# EasyEDA schematic schematic.json
TITLE: Roller System; REV: 1.2; Date: 2018-11-19; Sheet: 1/1; Drawn By: saikek
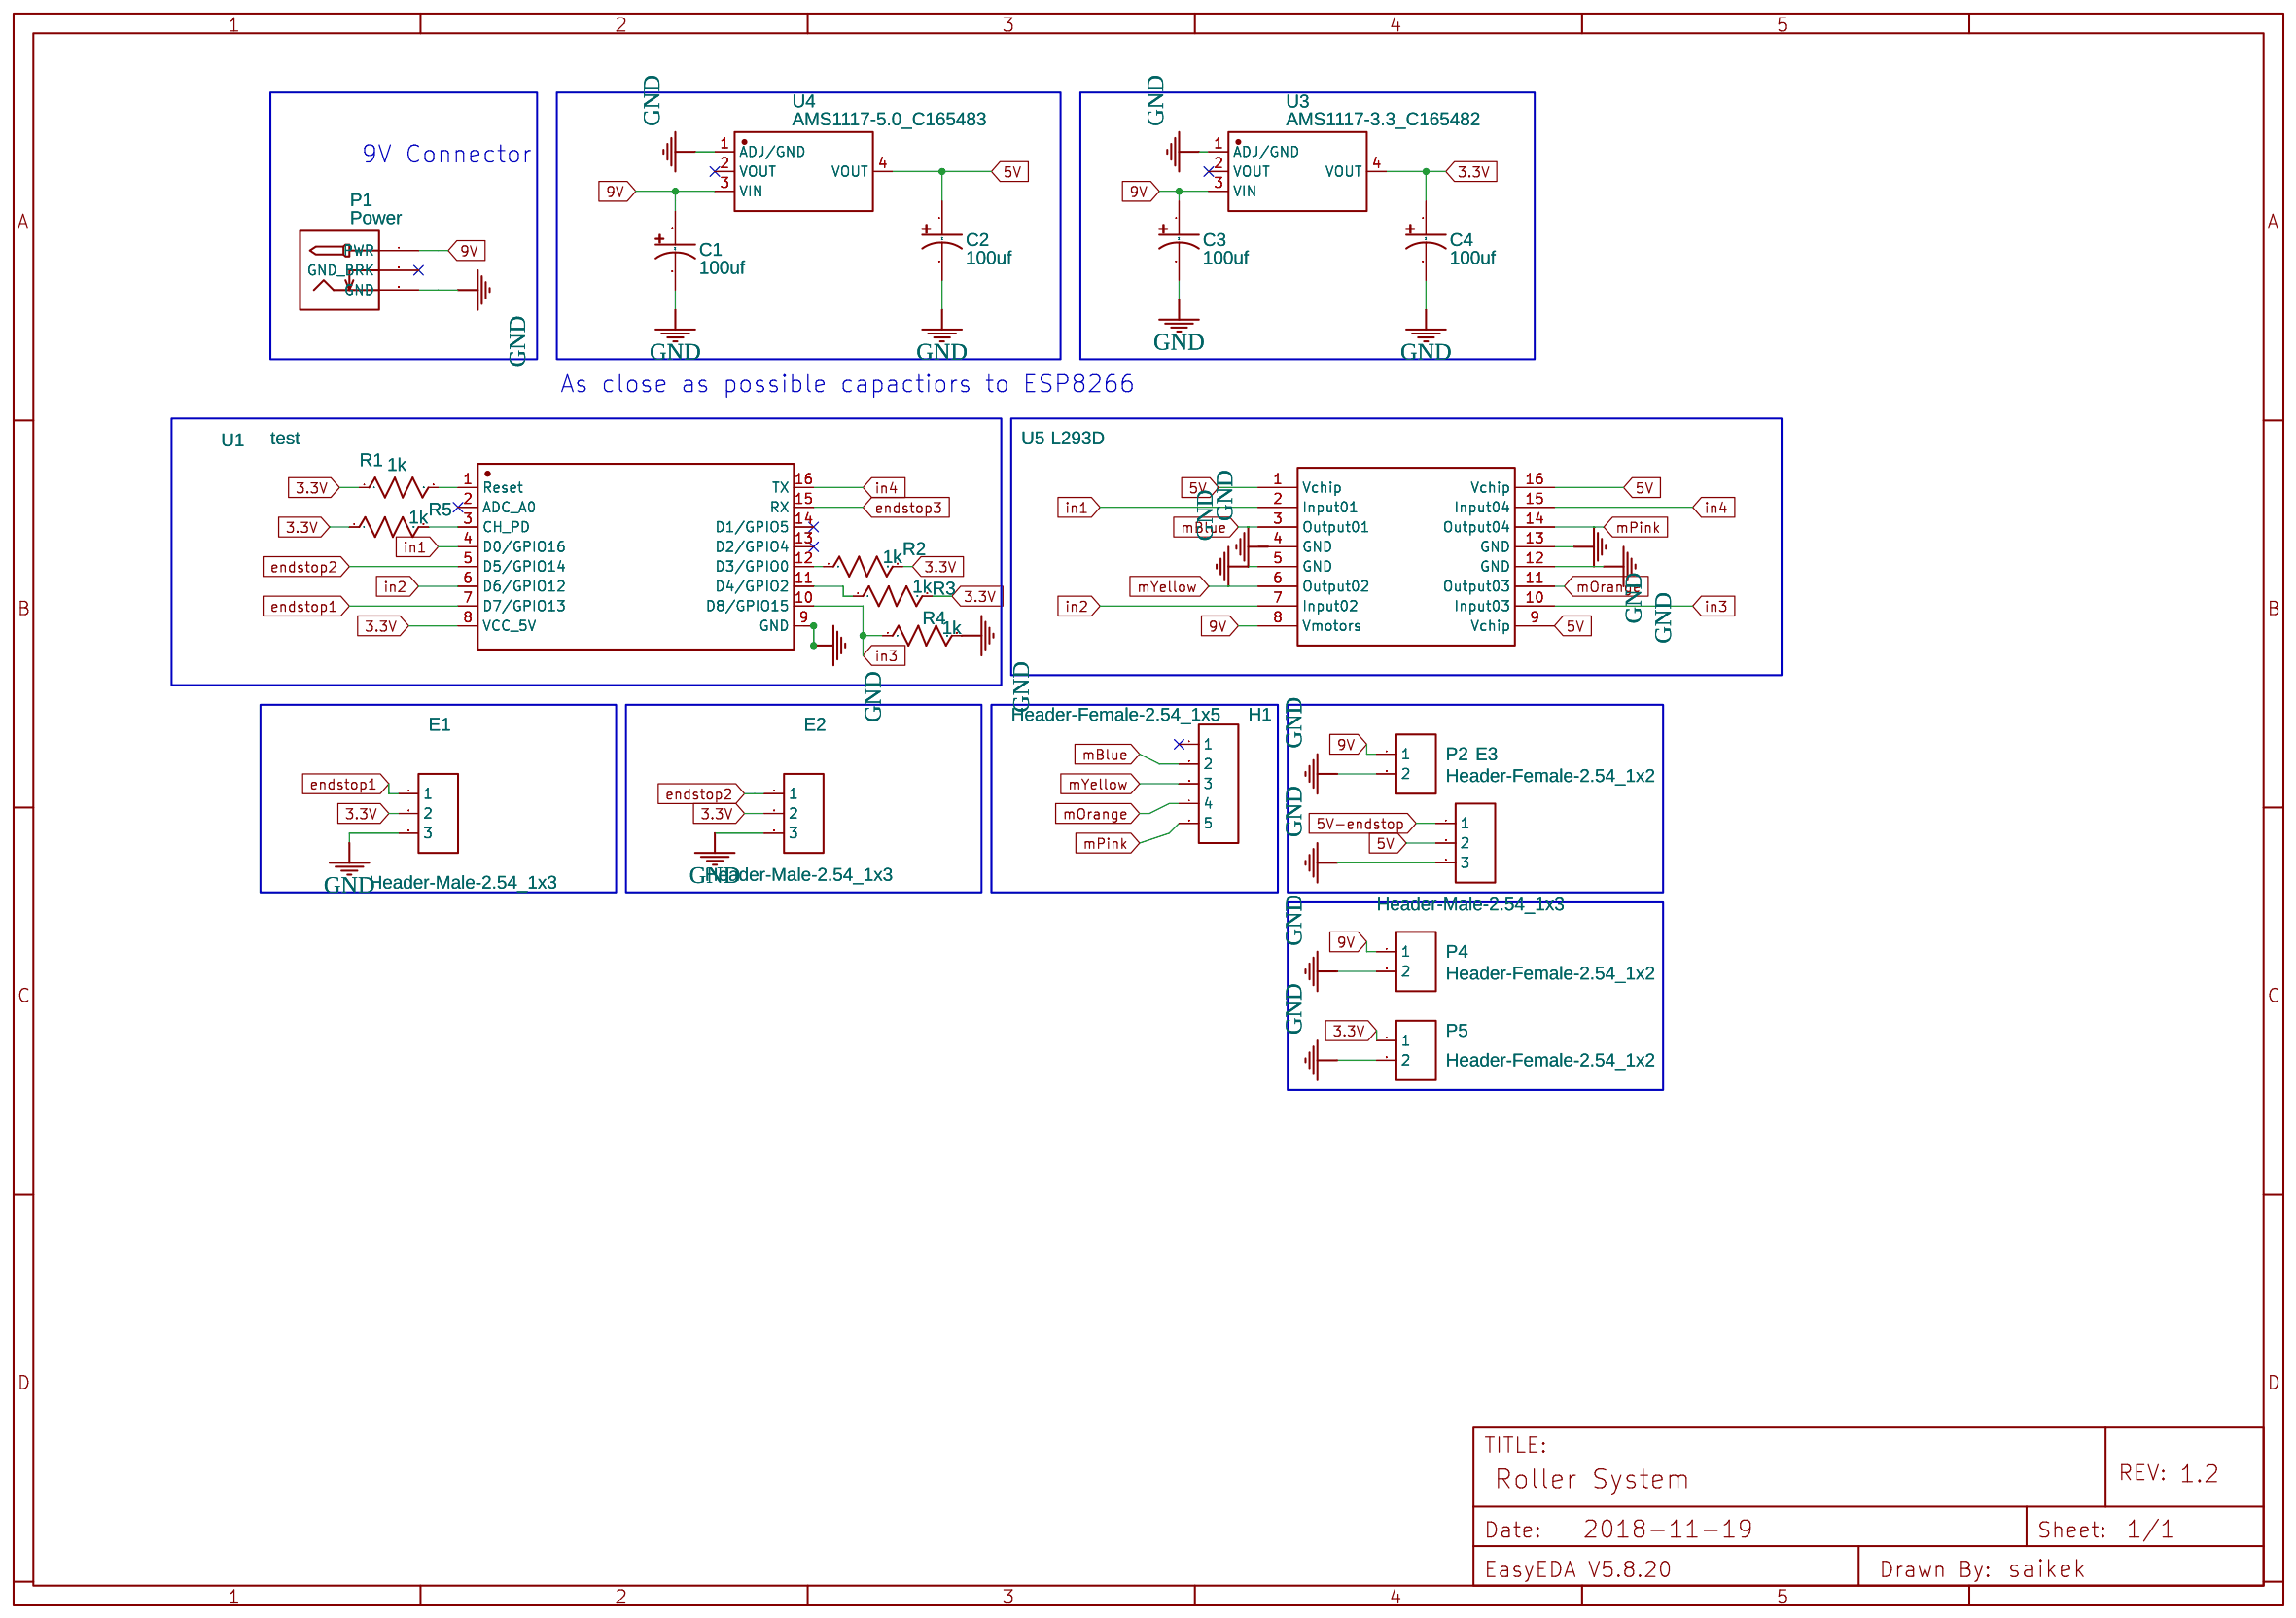
[diagram p0: schematic sheet]

## Parts
C1  100uf  [0805]
C2  100uf  [0805]
C3  100uf  [0805]
C4  100uf  [0805]
E1  Header-Male-2.54_1x3  [HDR-3X1/2.54]
E2  Header-Male-2.54_1x3  [HDR-3X1/2.54]
E3  Header-Male-2.54_1x3  [HDR-3X1/2.54]
H1  Header-Female-2.54_1x5  [HDR-5X1/2.54]
P1  Power  [PJ-002A]
P2  Header-Female-2.54_1x2  [HDR-1X2/2.54]
P4  Header-Female-2.54_1x2  [HDR-1X2/2.54]
P5  Header-Female-2.54_1x2  [HDR-1X2/2.54]
R1  1k  [0805]
R2  1k  [0805]
R3  1k  [0805]
R4  1k  [0805]
R5  1k  [0805]
U1  test  [WITTY CLOUD ESP8266 12F]
U3  AMS1117-3.3_C165482  [SOT-223]
U4  AMS1117-5.0_C165483  [SOT-223]
U5  L293D  [DIP-16]

## Library data of the parts
C1-C4 = Cap_Electrolytic(TH)_D3.0XF1.5_US: Manufacturer Part: ?
E1-E3 = -: Supplier Part: C49257; Supplier: LCSC; Manufacturer: BOOMELE; Manufacturer Part: Header2.54mm 1*3P; image: //image.lceda.cn/szlcsc/C49257.jpg
H1 = -: Supplier: LCSC; Manufacturer: BOOMELE; Manufacturer Part: 2.54mm 1*5p Female header; image: //image.lceda.cn/szlcsc/C50950.jpg; Supplier Part: C50950
P1 = -: Supplier Part: C68942; Supplier: LCSC; Manufacturer: LCSC; Manufacturer Part: DC005-2.1MM
P2 P4 P5 = -: Supplier: LCSC; Manufacturer: BOOMELE; Manufacturer Part: 2.54-1*2PFemale; image: //image.lceda.cn/szlcsc/C49661.jpg; Supplier Part: C49661
R1-R5 = Res_0805(1/8W)_US: Manufacturer Part: ?
U1 = -: Manufacturer Part: ?
U3 = -: Supplier: LCSC; Manufacturer: SK; Manufacturer Part: AMS1117-3.3; Contributor: LCSC; Supplier Part: C165482
U4 = -: Supplier: LCSC; Manufacturer: SK; Manufacturer Part: AMS1117-5.0; Contributor: LCSC; Supplier Part: C165483
U5 = -: Contributor: LCSC; Supplier: LCSC; Manufacturer: STMicroelectronics; image: //image.lceda.cn/szlcsc/C12340.jpg; Supplier Part: C12340

## Nets
3.3V: C4.1 E1.2 E2.2 P5.1 R1.1 R2.2 R3.2 R5.1 U1.8(VCC_5V) U3.4(VOUT)
5V: C2.1 E3.2 U4.4(VOUT) U5.1(Vchip) U5.9(Vchip) U5.16(Vchip)
5V-endstop: E3.1
9V: C1.1 C3.1 P1.1(PWR) P2.1 P4.1 U3.3(VIN) U4.3(VIN) U5.8(Vmotors)
GND: C1.2 C2.2 C3.2 C4.2 E1.3 E2.3 E3.3 P1.2(GND) P2.2 P4.2 P5.2 R4.2 U1.9(GND) U3.1(ADJ/GND) U4.1(ADJ/GND) U5.4(GND) U5.5(GND) U5.12(GND) U5.13(GND)
endstop1: E1.1 U1.7(D7/GPIO13)
endstop2: E2.1 U1.5(D5/GPIO14)
endstop3: U1.15(RX)
in1: U1.4(D0/GPIO16) U5.2(Input01)
in2: U1.6(D6/GPIO12) U5.7(Input02)
in3: R4.1 U1.10(D8/GPIO15) U5.10(Input03)
in4: U1.16(TX) U5.15(Input04)
mBlue: H1.2 U5.3(Output01)
mOrange: H1.4 U5.11(Output03)
mPink: H1.5 U5.14(Output04)
mYellow: H1.3 U5.6(Output02)
Net-(R1-2): R1.2 U1.1(Reset)
Net-(R2-1): R2.1 U1.12(D3/GPIO0)
Net-(R3-1): R3.1 U1.11(D4/GPIO2)
Net-(R5-2): R5.2 U1.3(CH_PD)

Not connected (* = marked no-connect by the designer): H1 1*; P1 3(GND_BRK)*; U1 2(ADC_A0)* 13(D2/GPIO4)* 14(D1/GPIO5)*; U3 2(VOUT)*; U4 2(VOUT)*

## Notes on the sheet
- 9V Connector
- As close as possible capactiors to ESP8266
